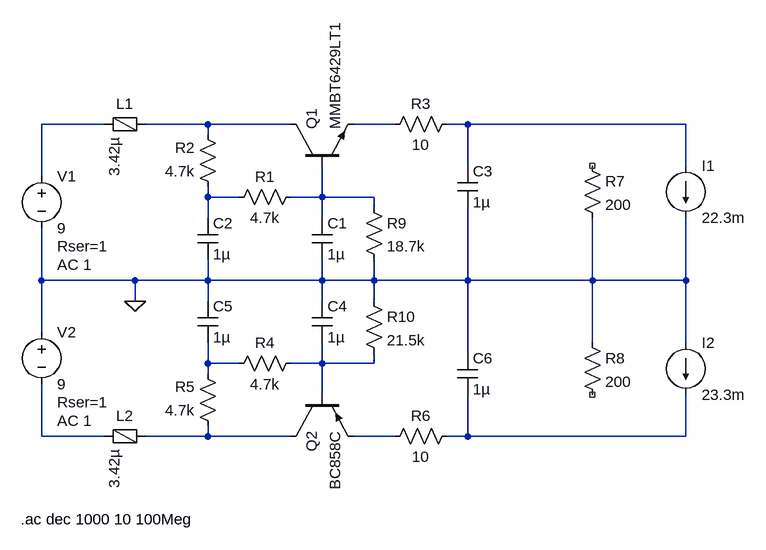
[diagram p0: schematic cmult.asc]
cmult.asc, the LTspice schematic file:
Version 4
SHEET 1 880 680
WIRE -192 -80 -288 -80
WIRE -32 -80 -128 -80
WIRE 96 -80 -32 -80
WIRE 256 -80 192 -80
WIRE 368 -80 336 -80
WIRE 704 -80 368 -80
WIRE -32 -64 -32 -80
WIRE 368 -16 368 -80
WIRE 704 -16 704 -80
WIRE -288 0 -288 -80
WIRE -32 32 -32 16
WIRE 16 32 -32 32
WIRE 144 32 144 -16
WIRE 144 32 96 32
WIRE 224 32 144 32
WIRE 224 48 224 32
WIRE -32 64 -32 32
WIRE 144 64 144 32
WIRE -288 160 -288 80
WIRE -144 160 -288 160
WIRE -32 160 -32 128
WIRE -32 160 -144 160
WIRE 144 160 144 128
WIRE 144 160 -32 160
WIRE 224 160 224 128
WIRE 224 160 144 160
WIRE 368 160 368 48
WIRE 368 160 224 160
WIRE 560 160 560 64
WIRE 560 160 368 160
WIRE 704 160 704 64
WIRE 704 160 560 160
WIRE -144 192 -144 160
WIRE -32 192 -32 160
WIRE 144 192 144 160
WIRE 224 192 224 160
WIRE -288 240 -288 160
WIRE 560 256 560 160
WIRE 704 256 704 160
WIRE 368 272 368 160
WIRE -32 288 -32 256
WIRE 16 288 -32 288
WIRE 144 288 144 256
WIRE 144 288 96 288
WIRE 224 288 224 272
WIRE 224 288 144 288
WIRE -32 304 -32 288
WIRE 144 336 144 288
WIRE -288 400 -288 320
WIRE -192 400 -288 400
WIRE -32 400 -32 384
WIRE -32 400 -128 400
WIRE 96 400 -32 400
WIRE 256 400 192 400
WIRE 368 400 368 336
WIRE 368 400 336 400
WIRE 704 400 704 336
WIRE 704 400 368 400
FLAG -144 192 0
SYMBOL npn 96 -16 R270
SYMATTR InstName Q1
SYMATTR Value MMBT6429LT1
SYMBOL pnp 96 336 M90
SYMATTR InstName Q2
SYMATTR Value BC858C
SYMBOL res 112 16 R90
WINDOW 0 0 56 VBottom 2
WINDOW 3 32 56 VTop 2
SYMATTR InstName R1
SYMATTR Value 4.7k
SYMBOL res -16 32 R180
WINDOW 0 36 76 Left 2
WINDOW 3 36 40 Left 2
SYMATTR InstName R2
SYMATTR Value 4.7k
SYMBOL res 240 -64 R270
WINDOW 0 32 56 VTop 2
WINDOW 3 0 56 VBottom 2
SYMATTR InstName R3
SYMATTR Value 10
SYMBOL res 112 272 R90
WINDOW 0 0 56 VBottom 2
WINDOW 3 32 56 VTop 2
SYMATTR InstName R4
SYMATTR Value 4.7k
SYMBOL res -16 400 R180
WINDOW 0 36 76 Left 2
WINDOW 3 36 40 Left 2
SYMATTR InstName R5
SYMATTR Value 4.7k
SYMBOL res 240 416 R270
WINDOW 0 32 56 VTop 2
WINDOW 3 0 56 VBottom 2
SYMATTR InstName R6
SYMATTR Value 10
SYMBOL cap 128 64 R0
SYMATTR InstName C1
SYMATTR Value 1µ
SYMBOL cap -48 64 R0
SYMATTR InstName C2
SYMATTR Value 1µ
SYMBOL cap 352 -16 R0
SYMATTR InstName C3
SYMATTR Value 1µ
SYMBOL cap 128 192 R0
SYMATTR InstName C4
SYMATTR Value 1µ
SYMBOL cap -48 192 R0
SYMATTR InstName C5
SYMATTR Value 1µ
SYMBOL cap 352 272 R0
SYMATTR InstName C6
SYMATTR Value 1µ
SYMBOL res 544 -32 R0
SYMATTR InstName R7
SYMATTR Value 200
SYMBOL res 544 240 R0
SYMATTR InstName R8
SYMATTR Value 200
SYMBOL voltage -288 -16 R0
WINDOW 123 24 152 Left 2
WINDOW 39 24 124 Left 2
SYMATTR Value2 AC 1
SYMATTR SpiceLine Rser=1
SYMATTR InstName V1
SYMATTR Value 9
SYMBOL voltage -288 224 R0
WINDOW 123 24 152 Left 2
WINDOW 39 24 124 Left 2
SYMATTR Value2 AC 1
SYMATTR SpiceLine Rser=1
SYMATTR InstName V2
SYMATTR Value 9
SYMBOL FerriteBead -160 -80 R90
WINDOW 0 -16 0 VBottom 2
SYMATTR InstName L1
SYMATTR Value 3.42µ
SYMATTR SpiceLine Ipk=0.2 Rser=0.6 Rpar=2780 Cpar=970f mfg="Würth Elektronik" pn="742 792 093"
SYMBOL FerriteBead -160 400 R90
WINDOW 0 -16 0 VBottom 2
SYMATTR InstName L2
SYMATTR Value 3.42µ
SYMATTR SpiceLine Ipk=0.2 Rser=0.6 Rpar=2780 Cpar=970f mfg="Würth Elektronik" pn="742 792 093"
SYMBOL current 704 -16 R0
WINDOW 123 0 0 Left 0
WINDOW 39 0 0 Left 0
SYMATTR InstName I1
SYMATTR Value 22.3m
SYMBOL current 704 256 R0
WINDOW 123 0 0 Left 0
WINDOW 39 0 0 Left 0
SYMATTR InstName I2
SYMATTR Value 23.3m
SYMBOL res 208 32 R0
SYMATTR InstName R9
SYMATTR Value 18.7k
SYMBOL res 208 176 R0
SYMATTR InstName R10
SYMATTR Value 21.5k
TEXT -320 528 Left 2 !.ac dec 1000 10 100Meg

The netlist it stands for:
* cmult.asc
Q1 N002 N006 N003 0 MMBT6429LT1
Q2 N010 N008 N011 0 BC858C
R1 N006 N005 4.7k
R2 N005 N002 4.7k
R3 N003 N004 10
R4 N008 N007 4.7k
R5 N010 N007 4.7k
R6 N011 N012 10
C1 N006 0 1µ
C2 N005 0 1µ
C3 N004 0 1µ
C4 0 N008 1µ
C5 0 N007 1µ
C6 0 N012 1µ
R7 NC_01 0 200
R8 0 NC_02 200
V1 N001 0 9 AC 1 Rser=1
V2 0 N009 9 AC 1 Rser=1
L1 N002 N001 3.42µ Ipk=0.2 Rser=0.6 Rpar=2780 Cpar=970f mfg="Würth Elektronik" pn="742 792 093"
L2 N010 N009 3.42µ Ipk=0.2 Rser=0.6 Rpar=2780 Cpar=970f mfg="Würth Elektronik" pn="742 792 093"
I1 N004 0 22.3m
I2 0 N012 23.3m
R9 N006 0 18.7k
R10 0 N008 21.5k
.model NPN NPN
.model PNP PNP
.lib standard.bjt
.ac dec 1000 10 100Meg
.backanno
.end